# EAGLE design Mergen Telemetri + Ateşleme (EAGLE 9.6.2)

## Sheet 1 of 7
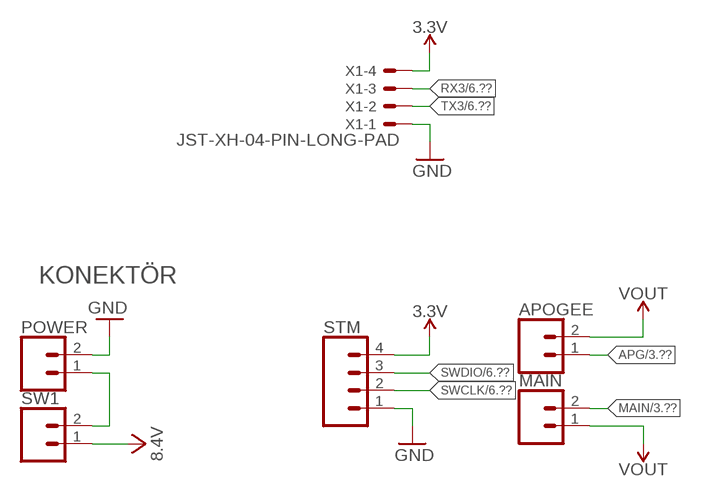
[diagram p0: schematic, sheet 1]

### Parts
APOGEE  CONN_023.5MM-NO_SILK  [SCREWTERMINAL-3.5MM-2-NS]
MAIN  CONN_023.5MM-NO_SILK  [SCREWTERMINAL-3.5MM-2-NS]
POWER  CONN_023.5MM-NO_SILK  [SCREWTERMINAL-3.5MM-2-NS]
STM  CONN_04  [1X04]
SW1  CONN_023.5MM-NO_SILK  [SCREWTERMINAL-3.5MM-2-NS]
X1  JST-XH-04-PIN-LONG-PAD  [JST-XH-04-PACKAGE-LONG-PAD]

### Nets
3.3V: STM.4 X1.4 ; also sheet 2,4,6,7
APG: APOGEE.1 ; also sheet 3
GND: POWER.2 STM.1 X1.1 ; also sheet 2,3,4,5,6,7
MAIN: MAIN.2 ; also sheet 3
N$9: POWER.1 SW1.2
RX3: X1.3 ; also sheet 6
SWCLK: STM.2 ; also sheet 6
SWDIO: STM.3 ; also sheet 6
TX3: X1.2 ; also sheet 6
VCC: SW1.1 ; supply symbol labelled 8.4V ; also sheet 7
VOUT: APOGEE.2 MAIN.1 ; also sheet 7

### Notes on the sheet
- KONEKTÖR

## Sheet 2 of 7
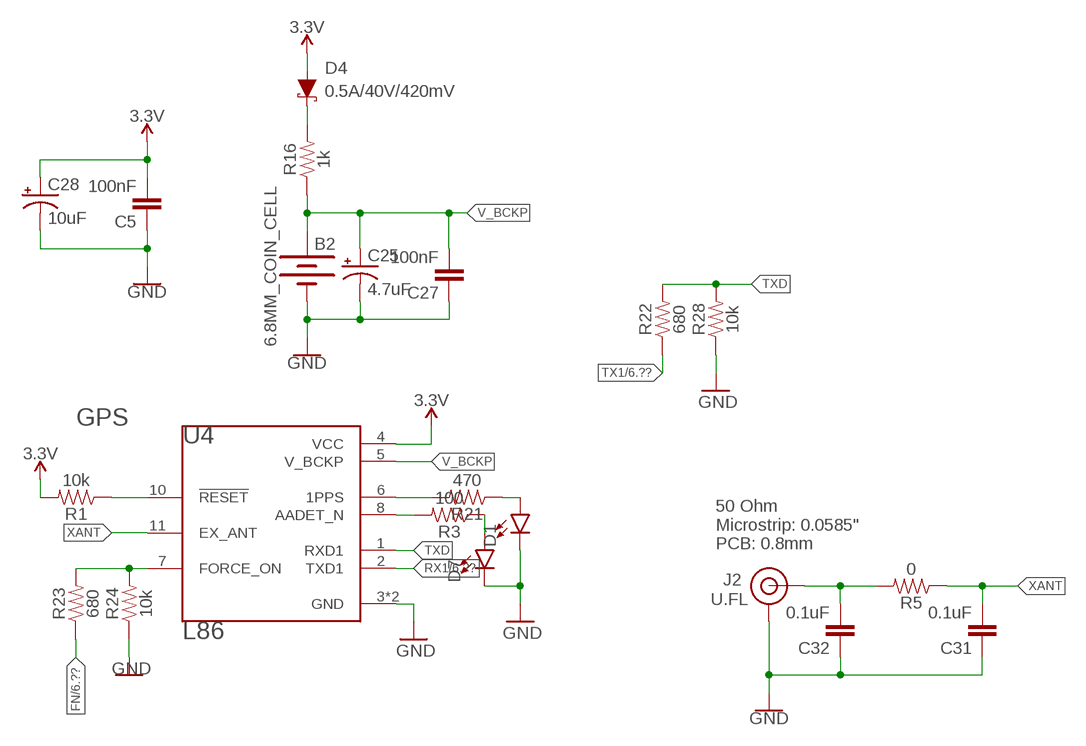
[diagram p1: schematic, sheet 2]

### Parts
B2  6.8MM_COIN_CELL  BATTERY-6.8MM_SMD  [BATTCON-6.8MM]
C5  100nF  1.0UF-0603-16V-10%  [0603]
C25  4.7uF  10UF-POLAR-EIA3216-16V-10%(TANT)  [EIA3216]
C27  100nF  1.0UF-0603-16V-10%  [0603]
C28  10uF  10UF-POLAR-EIA3216-16V-10%(TANT)  [EIA3216]
C31  0.1uF  1.0UF-0603-16V-10%  [0603]
C32  0.1uF  1.0UF-0603-16V-10%  [0603]
D1  LED0603  [LED-0603]
D4  0.5A/40V/420mV  DIODE-SCHOTTKY-PMEG4005EJ  [SOD-323]
D7  LED0603  [LED-0603]
J2  U.FL  U.FL2PIN  [U.FL]
R1  10k  1KOHM-0603-1/10W-1%  [0603]
R3  100  1KOHM-0603-1/10W-1%  [0603]
R5  0  1KOHM-0603-1/10W-1%  [0603]
R16  1k  1KOHM-0603-1/10W-1%  [0603]
R21  470  1KOHM-0603-1/10W-1%  [0603]
R22  680  1KOHM-0603-1/10W-1%  [0603]
R23  680  1KOHM-0603-1/10W-1%  [0603]
R24  10k  1KOHM-0603-1/10W-1%  [0603]
R28  10k  1KOHM-0603-1/10W-1%  [0603]
U4  L86  [XCVR_L86]

### Nets
3.3V: C5.2 C28.+ D4.A R1.2 U4.4(VCC) ; also sheet 1,4,6,7
FN: R23.1 ; also sheet 6
GND: B2.- C5.1 C25.- C27.1 C28.- C31.1 C32.1 D1.C D7.C J2.1(GND) J2.2(GND) R24.1 R28.1 U4.3(GND) U4.12(GND) ; also sheet 1,3,4,5,6,7
N$3: R1.1 U4.10(!RESET)
N$10: R21.2 U4.6(1PPS)
N$11: D1.A R21.1
N$12: D4.C R16.2
N$16: R3.2 U4.8(AADET_N)
N$17: D7.A R3.1
N$19: C32.2 J2.FEED(SIGNAL) R5.2
N$20: R23.2 R24.2 U4.7(FORCE_ON)
RX1: U4.2(TXD1) ; also sheet 6
TX1: R22.1 ; also sheet 6
TXD: R22.2 R28.2 U4.1(RXD1)
V_BCKP: B2.+ C25.+ C27.2 R16.1 U4.5(V_BCKP)
XANT: C31.2 R5.1 U4.11(EX_ANT)

### Notes on the sheet
- GPS
- 50 Ohm 
  Microstrip: 0.0585"
  PCB: 0.8mm

## Sheet 3 of 7
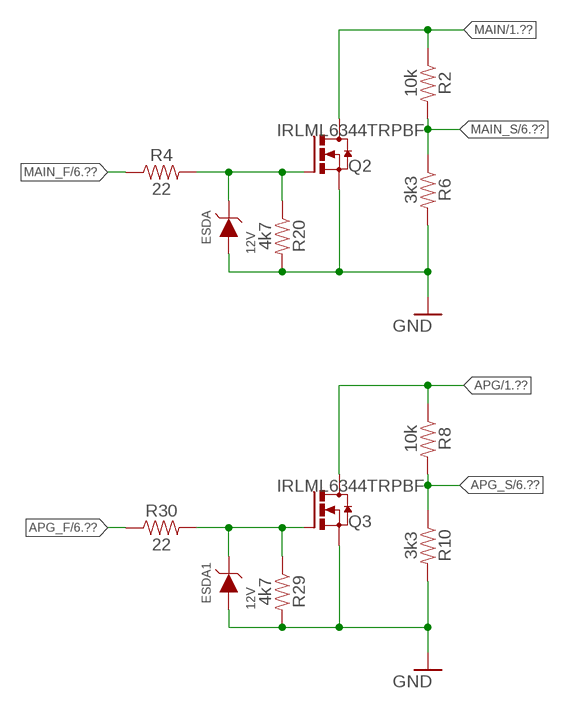
[diagram p2: schematic, sheet 3]

### Parts
ESDA  12V  WE-TVSP_DO-214AC_400W_UNI_824500102  [WE-TVSP_DO-214AC_UNIDIRECTIONAL]
ESDA1  12V  WE-TVSP_DO-214AC_400W_UNI_824500102  [WE-TVSP_DO-214AC_UNIDIRECTIONAL]
Q2  IRLML6344TRPBF  [SOT23]
Q3  IRLML6344TRPBF  [SOT23]
R2  10k  1KOHM-0603-1/10W-1%  [0603]
R4  22  1KOHM-0603-1/10W-1%  [0603]
R6  3k3  1KOHM-0603-1/10W-1%  [0603]
R8  10k  1KOHM-0603-1/10W-1%  [0603]
R10  3k3  1KOHM-0603-1/10W-1%  [0603]
R20  4k7  1KOHM-0603-1/10W-1%  [0603]
R29  4k7  1KOHM-0603-1/10W-1%  [0603]
R30  22  1KOHM-0603-1/10W-1%  [0603]

### Nets
APG: Q3.3(D) R8.1 ; also sheet 1
APG_F: R30.1 ; also sheet 6
APG_S: R8.2 R10.1 ; also sheet 6
GND: ESDA1.2(A) ESDA.2(A) Q2.2(S) Q3.2(S) R6.2 R10.2 R20.2 R29.2 ; also sheet 1,2,4,5,6,7
MAIN: Q2.3(D) R2.1 ; also sheet 1
MAIN_F: R4.1 ; also sheet 6
MAIN_S: R2.2 R6.1 ; also sheet 6
N$6: ESDA1.1(C) Q3.1(G) R29.1 R30.2
N$13: ESDA.1(C) Q2.1(G) R4.2 R20.1

## Sheet 4 of 7
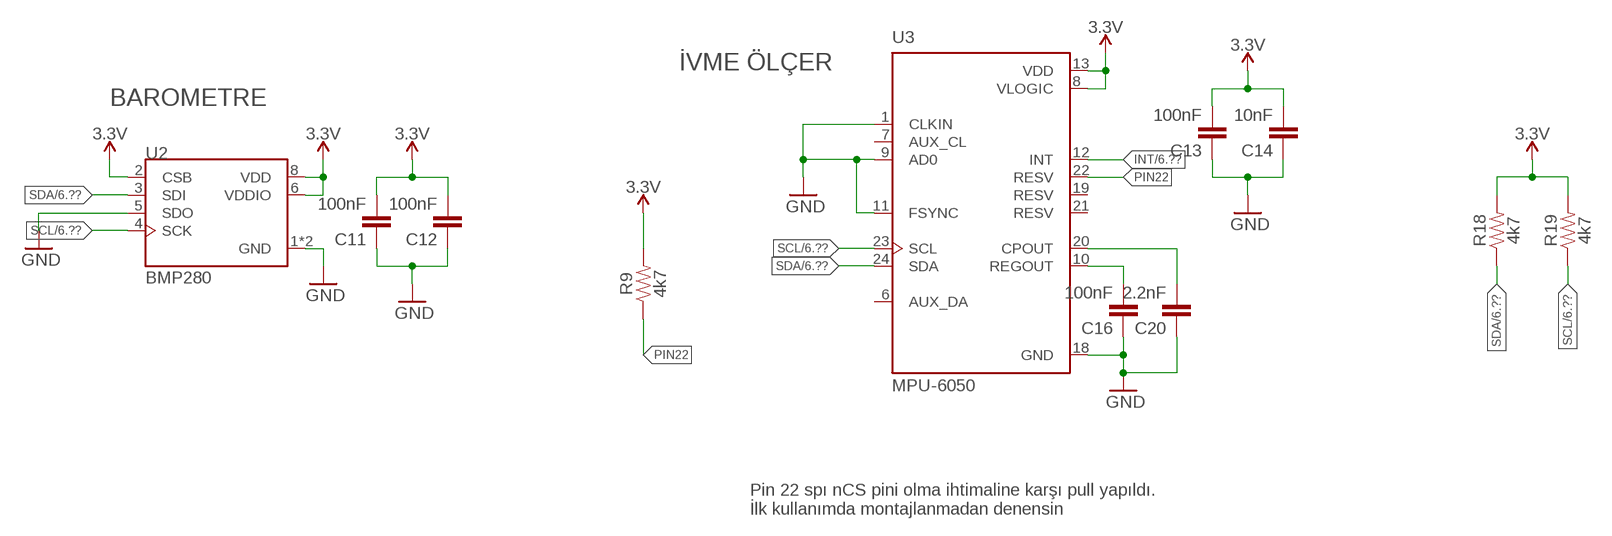
[diagram p3: schematic, sheet 4]

### Parts
C11  100nF  1.0UF-0603-16V-10%  [0603]
C12  100nF  1.0UF-0603-16V-10%  [0603]
C13  100nF  1.0UF-0603-16V-10%  [0603]
C14  10nF  1.0UF-0603-16V-10%  [0603]
C16  100nF  1.0UF-0603-16V-10%  [0603]
C20  2.2nF  1.0UF-0603-16V-10%  [0603]
R9  4k7  1KOHM-0603-1/10W-1%  [0603]
R18  4k7  1KOHM-0603-1/10W-1%  [0603]
R19  4k7  1KOHM-0603-1/10W-1%  [0603]
U2  BMP280  [XDCR_BMP280]
U3  MPU-6050  [QFN50P400X400X95-24N]

### Nets
3.3V: C11.2 C12.2 C13.2 C14.2 R9.2 R18.2 R19.2 U2.2(CSB) U2.6(VDDIO) U2.8(VDD) U3.8(VLOGIC) U3.13(VDD) ; also sheet 1,2,6,7
GND: C11.1 C12.1 C13.1 C14.1 C16.1 C20.1 U2.1(GND) U2.5(SDO) U2.7(GND) U3.1(CLKIN) U3.9(AD0) U3.11(FSYNC) U3.18(GND) ; also sheet 1,2,3,5,6,7
INT: U3.12(INT) ; also sheet 6
N$18: C16.2 U3.10(REGOUT)
N$22: C20.2 U3.20(CPOUT)
PIN22: R9.1 U3.22(RESV)
SCL: R19.1 U2.4(SCK) U3.23(SCL) ; also sheet 6
SDA: R18.1 U2.3(SDI) U3.24(SDA) ; also sheet 6
Unconnected: U3.6(AUX_DA) U3.7(AUX_CL) U3.19(RESV) U3.21(RESV)

### Notes on the sheet
- İVME ÖLÇER
- BAROMETRE
- Pin 22 spı nCS pini olma ihtimaline karşı pull yapıldı. 
  İlk kullanımda montajlanmadan denensin

## Sheet 5 of 7
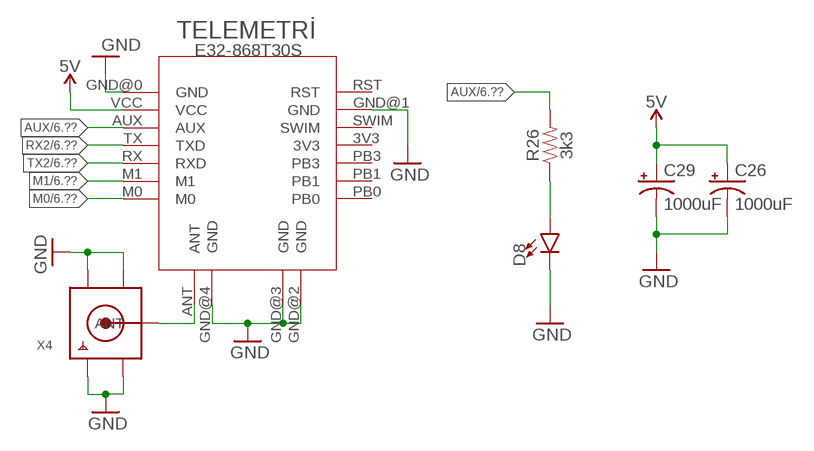
[diagram p4: schematic, sheet 5]

### Parts
C26  1000uF  CPOL-US150CLZ-1010  [150CLZ-1010]
C29  1000uF  CPOL-US150CLZ-1010  [150CLZ-1010]
D8  LED0603  [LED-0603]
R26  3k3  1KOHM-0603-1/10W-1%  [0603]
U5  E32-868T30S  [E32-868T30S]
X4  SMACONNECTOR  [SMA90_DIP]

### Nets
5V: C26.+ C29.+ U5.VCC ; also sheet 7
AUX: R26.2 U5.AUX ; also sheet 6
GND: C26.- C29.- D8.C U5.GND@0(GND) U5.GND@1(GND) U5.GND@2(GND) U5.GND@3(GND) U5.GND@4(GND) X4.GND1 X4.GND2 X4.GND3 X4.GND4 ; also sheet 1,2,3,4,6,7
M0: U5.M0 ; also sheet 6
M1: U5.M1 ; also sheet 6
N$7: U5.ANT X4.ANTENNA(ANT)
N$21: D8.A R26.1
RX2: U5.TX(TXD) ; also sheet 6
TX2: U5.RX(RXD) ; also sheet 6
Unconnected: U5.3V3 U5.PB0 U5.PB1 U5.PB3 U5.RST U5.SWIM

### Notes on the sheet
- TELEMETRİ

## Sheet 6 of 7
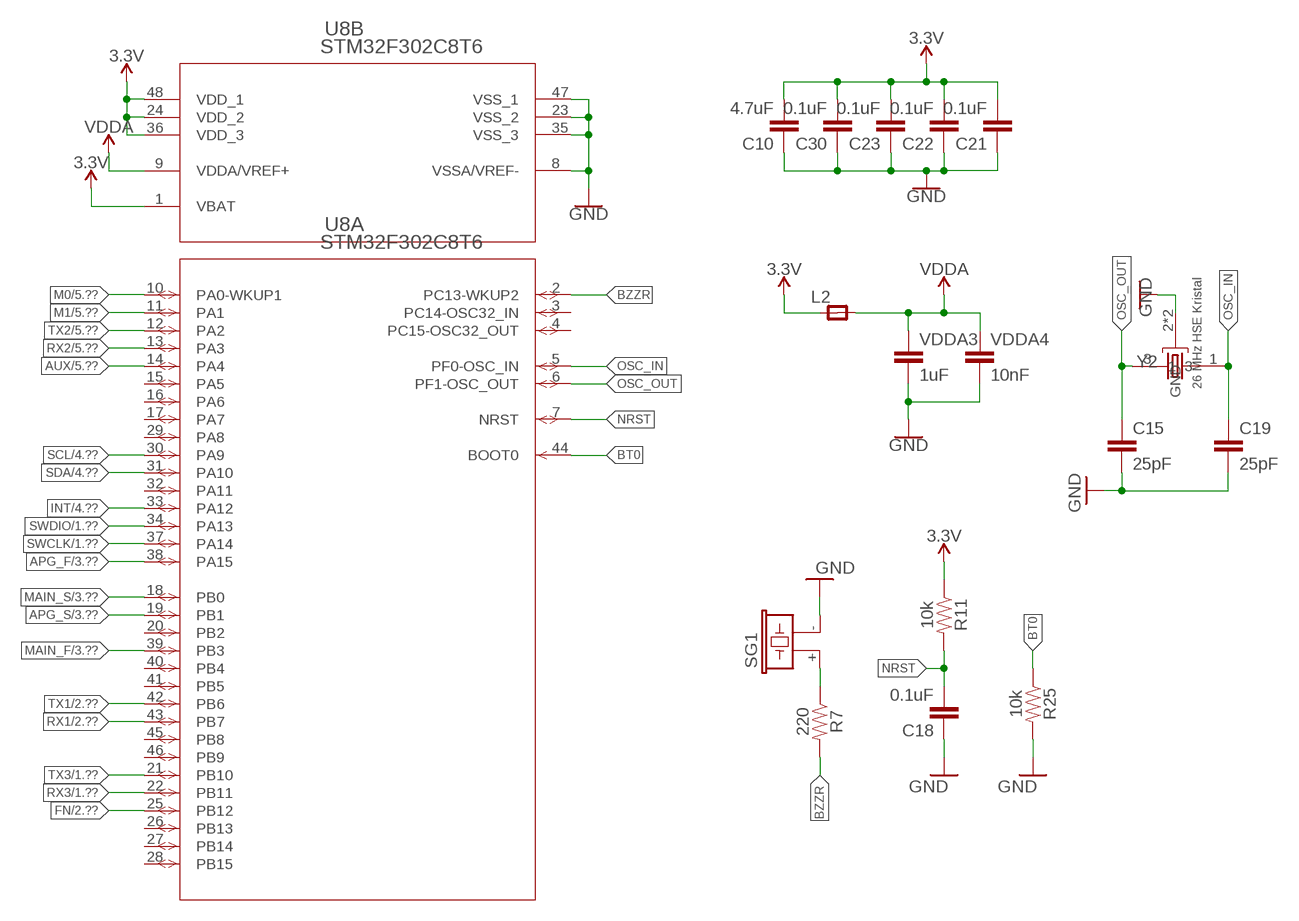
[diagram p5: schematic, sheet 6]

### Parts
C10  4.7uF  1.0UF-0603-16V-10%  [0603]
C15  25pF  1.0UF-0603-16V-10%  [0603]
C18  0.1uF  1.0UF-0603-16V-10%  [0603]
C19  25pF  1.0UF-0603-16V-10%  [0603]
C21  0.1uF  1.0UF-0603-16V-10%  [0603]
C22  0.1uF  1.0UF-0603-16V-10%  [0603]
C23  0.1uF  1.0UF-0603-16V-10%  [0603]
C30  0.1uF  1.0UF-0603-16V-10%  [0603]
L2  RC-MASTER-SMD_FB_0805MP  [RC-MASTER-SMD_L0805MP]
R7  220  1KOHM-0603-1/10W-1%  [0603]
R11  10k  1KOHM-0603-1/10W-1%  [0603]
R25  10k  1KOHM-0603-1/10W-1%  [0603]
SG1  F/CM12P  [F/CM12P]
U8  STM32F302C8T6  [LQFP48-7X7MM]
VDDA3  1uF  0.1UF-0603-25V-(+80/-20%)  [0603]
VDDA4  10nF  0.1UF-0603-25V-(+80/-20%)  [0603]
Y2  ABM3B-26.000MHZ-10-1-U-T  [OSCCC500X320X110-4N]

### Nets
3.3V: C10.2 C21.2 C22.2 C23.2 C30.2 L2.1 R11.1 U8.1(B:VBAT) U8.24(B:VDD_2) U8.36(B:VDD_3) U8.48(B:VDD_1) ; also sheet 1,2,4,7
APG_F: U8.38(A:PA15) ; also sheet 3
APG_S: U8.19(A:PB1) ; also sheet 3
AUX: U8.14(A:PA4) ; also sheet 5
BT0: R25.1 U8.44(A:BOOT0)
BZZR: R7.2 U8.2(A:PC13-WKUP2)
FN: U8.25(A:PB12) ; also sheet 2
GND: C10.1 C15.2 C18.1 C19.2 C21.1 C22.1 C23.1 C30.1 R25.2 SG1.- U8.8(B:VSSA/VREF-) U8.23(B:VSS_2) U8.35(B:VSS_3) U8.47(B:VSS_1) VDDA3.2 VDDA4.2 Y2.2(GND) Y2.4(GND) ; also sheet 1,2,3,4,5,7
INT: U8.33(A:PA12) ; also sheet 4
M0: U8.10(A:PA0-WKUP1) ; also sheet 5
M1: U8.11(A:PA1) ; also sheet 5
MAIN_F: U8.39(A:PB3) ; also sheet 3
MAIN_S: U8.18(A:PB0) ; also sheet 3
N$8: R7.1 SG1.+
NRST: C18.2 R11.2 U8.7(A:NRST)
OSC_IN: C19.1 U8.5(A:PF0-OSC_IN) Y2.1
OSC_OUT: C15.1 U8.6(A:PF1-OSC_OUT) Y2.3
RX1: U8.43(A:PB7) ; also sheet 2
RX2: U8.13(A:PA3) ; also sheet 5
RX3: U8.22(A:PB11) ; also sheet 1
SCL: U8.30(A:PA9) ; also sheet 4
SDA: U8.31(A:PA10) ; also sheet 4
SWCLK: U8.37(A:PA14) ; also sheet 1
SWDIO: U8.34(A:PA13) ; also sheet 1
TX1: U8.42(A:PB6) ; also sheet 2
TX2: U8.12(A:PA2) ; also sheet 5
TX3: U8.21(A:PB10) ; also sheet 1
VDDA: L2.2 U8.9(B:VDDA/VREF+) VDDA3.1 VDDA4.1
Unconnected: U8.3(A:PC14-OSC32_IN) U8.4(A:PC15-OSC32_OUT) U8.15(A:PA5) U8.16(A:PA6) U8.17(A:PA7) U8.20(A:PB2) U8.26(A:PB13) U8.27(A:PB14) U8.28(A:PB15) U8.29(A:PA8) U8.32(A:PA11) U8.40(A:PB4) U8.41(A:PB5) U8.45(A:PB8) U8.46(A:PB9)

### Notes on the sheet
- 26 MHz HSE Kristal

## Sheet 7 of 7
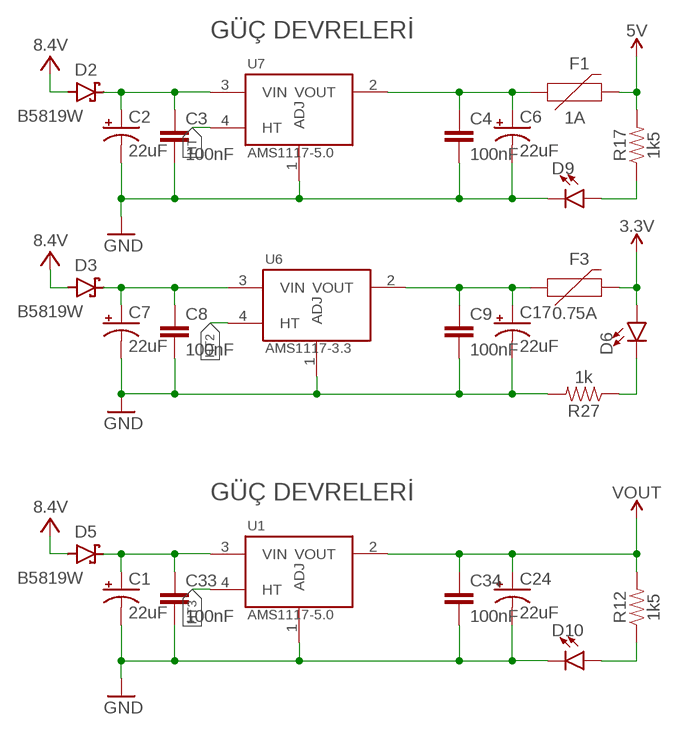
[diagram p6: schematic, sheet 7]

### Parts
C1  22uF  47UF-POLAR-EIA3528-10V-10%  [EIA3528]
C2  22uF  47UF-POLAR-EIA3528-10V-10%  [EIA3528]
C3  100nF  1.0UF-0603-16V-10%  [0603]
C4  100nF  1.0UF-0603-16V-10%  [0603]
C6  22uF  47UF-POLAR-EIA3528-10V-10%  [EIA3528]
C7  22uF  47UF-POLAR-EIA3528-10V-10%  [EIA3528]
C8  100nF  1.0UF-0603-16V-10%  [0603]
C9  100nF  1.0UF-0603-16V-10%  [0603]
C17  22uF  47UF-POLAR-EIA3528-10V-10%  [EIA3528]
C24  22uF  47UF-POLAR-EIA3528-10V-10%  [EIA3528]
C33  100nF  1.0UF-0603-16V-10%  [0603]
C34  100nF  1.0UF-0603-16V-10%  [0603]
D2  B5819W  SCHOTTKY_MBR0520LT1GDO-219  [SODFL3718X115]
D3  B5819W  SCHOTTKY_MBR0520LT1GDO-219  [SODFL3718X115]
D5  B5819W  SCHOTTKY_MBR0520LT1GDO-219  [SODFL3718X115]
D6  LED0603  [LED-0603]
D9  LED0603  [LED-0603]
D10  LED0603  [LED-0603]
F1  1A  PPTC_HALF-AMP  [1206]
F3  0.75A  PPTC_HALF-AMP  [1206]
R12  1k5  1KOHM-0603-1/10W-1%  [0603]
R17  1k5  1KOHM-0603-1/10W-1%  [0603]
R27  1k  1KOHM-0603-1/10W-1%  [0603]
U1  AMS1117-5.0  AMS1117-3.3  [SOT229P700X180-4N]
U6  AMS1117-3.3  [SOT229P700X180-4N]
U7  AMS1117-5.0  AMS1117-3.3  [SOT229P700X180-4N]

### Nets
3.3V: D6.A F3.2 ; also sheet 1,2,4,6
5V: F1.2 R17.2 ; also sheet 5
GND: C1.C(-) C2.C(-) C3.2 C4.2 C6.C(-) C7.C(-) C8.2 C9.2 C17.C(-) C24.C(-) C33.2 C34.2 D9.C D10.C R27.2 U1.1(ADJ) U6.1(ADJ) U7.1(ADJ) ; also sheet 1,2,3,4,5,6
HT: U7.4(HT)
HT2: U6.4(HT)
HT3: U1.4(HT)
N$1: C2.A(+) C3.1 D2.1(C) U7.3(VIN)
N$2: C7.A(+) C8.1 D3.1(C) U6.3(VIN)
N$4: C4.1 C6.A(+) F1.1 U7.2(VOUT)
N$5: C9.1 C17.A(+) F3.1 U6.2(VOUT)
N$14: D9.A R17.1
N$15: D6.C R27.1
N$23: C1.A(+) C33.1 D5.1(C) U1.3(VIN)
N$25: D10.A R12.1
VCC: D2.2(A) D3.2(A) D5.2(A) ; supply symbol labelled 8.4V ; also sheet 1
VOUT: C24.A(+) C34.1 R12.2 U1.2(VOUT) ; also sheet 1

### Notes on the sheet
- GÜÇ DEVRELERİ
- GÜÇ DEVRELERİ

## Library data of the parts
APOGEE MAIN POWER SW1 = SparkFun-Connectors:CONN_02: Multi connection point. Often used as Generic Header-pin footprint for 0.1 inch spaced/style header connections On any of the 0.1 inch spaced packages, you can populate with these: Break Away Headers - Straight <https://www.sparkfun.com/products/116> (PRT-00116) Break Away Male Headers - Right Angle <https://www.sparkfun.com/products/553> (PRT-00553) Female Headers <https://www.sparkfun.com/products/115> (PRT-00115) Break Away Headers - Machine Pin <https://www.sparkfun.com/products/117> (PRT-00117) Break Away Female Headers - Swiss Machine Pin <https://www.sparkfun.com/products/743> (PRT-00743) For SCREWTERMINALS and SPRING TERMINALS visit here: Screw Terimnals on SparkFun.com <https://www.sparkfun.com/search/results?term=Screw+Terminals> (5mm/3.5mm/2.54mm spacing) This device is also useful as a general connection point to wire up your design to another part of your project. Our various solder wires solder well into these plated through hole pads. Hook-Up Wire - Assortment (Stranded, 22 AWG) <https://www.sparkfun.com/products/11375> (PRT-11375) Hook-Up Wire - Assortment (Solid Core, 22 AWG) <https://www.sparkfun.com/products/11367> (PRT-11367) View the entire wire category on our website here <https://www.sparkfun.com/categories/141> Special notes: Molex polarized connector foot print use with: PRT-08233 with associated crimp pins and housings. 2.54_SCREWTERM for use with PRT-10571. 3.5mm Screw Terminal footprints for PRT-08084 5mm Screw Terminal footprints for use with PRT-08432; PROD_ID: CONN-08399
B2 = SparkFun-Batteries:BATTERY: Battery - Single Cell A variety of battery chemistries, sizes, and footprints. Device List: 20MM_PTH - Coin Cell Battery Holder - 20mm (PTH) <https://www.sparkfun.com/products/783> 6.8MM_PTH - Coin Cell Battery Holder - 6.8MM(SMD) <https://www.digikey.com/product-detail/en/seiko-instruments/MS621FE-FL11E/728-1057-ND/1889208?WT.srch=1&gclid=CNOQ5a6LzdQCFZS2wAodXCkE0g> 12MM_SMD - Coin Cell Battery Holder - 12mm (SMD) <https://www.sparkfun.com/products/10592> 12MM_PTH - Coin Cell Battery Holder - 12mm (PTH) <https://www.sparkfun.com/products/7948> 20MM_SMD - 20mm Coin Cell Battery Holder (SMD) (2 legs) Used on the Big Time Watch Kit <https://www.sparkfun.com/products/11734> 20MM_SMD_4LEGS - Coin Cell Battery Holder - 20mm (SMD) <https://www.sparkfun.com/products/11892> 20MM_SMD_4LEGS_OVERPASTE - Coin Cell Battery Holder - 20mm (SMD) <https://www.sparkfun.com/products/11892> (Over-paste on the legs) 24.5MM_PTH - Coin Cell Battery Holder - 24.5mm (PTH) <https://www.sparkfun.com/products/8863> 9V - 9V Battery Holder - PC Mount Used on the SparkFun SparkPunk Sound Kit <https://www.sparkfun.com/products/11177> and SparkFun SparkPunk Sequencer Kit <https://www.sparkfun.com/products/12707> 18650 - Battery Holder - 18650 (PTH) <https://www.sparkfun.com/products/13113> AA - Battery Holder - 1xAA (PTH) <https://www.sparkfun.com/products/7949> AAA - Battery Holder - 1xAAA (PTH) <https://www.sparkfun.com/products/12718> AA_KIT - Battery Holder - 1xAA (PTH) <https://www.sparkfun.com/products/7949> Special kit package - pads only have exposed copper on one side of the board. AAA_KIT - Battery Holder - 1xAAA (PTH) <https://www.sparkfun.com/products/12718> Special kit package - pads only have exposed copper on one side of the board.; PROD_ID: BATT-13734
C1 C2 C6 C7 C17 C24 = SparkFun-Capacitors:47UF-POLAR: 47µF polarized capacitors A capacitor is a passive two-terminal electrical component used to store electrical energy temporarily in an electric field.; PROD_ID: CAP-08310; VALUE: 47uF
C3-C5 C8-C16 C18-C23 C27 C30-C34 = SparkFun-Capacitors:1.0UF: 1µF ceramic capacitors A capacitor is a passive two-terminal electrical component used to store electrical energy temporarily in an electric field.; PROD_ID: CAP-00868; VALUE: 1.0uF
C25 = SparkFun-Capacitors:10UF-POLAR: 10.0µF polarized capacitors A capacitor is a passive two-terminal electrical component used to store electrical energy temporarily in an electric field.; PROD_ID: CAP-00811; VALUE: 10uF
C26 C29 = adafruit:CPOL-US: POLARIZED CAPACITOR, American symbol
C28 = SparkFun-Capacitors:10UF-POLAR: 10.0µF polarized capacitors A capacitor is a passive two-terminal electrical component used to store electrical energy temporarily in an electric field.; PROD_ID: CAP-00811
D1 D6-D10 = SparkFun-LED:LED: LED (Generic) Standard schematic elements and footprints for 5mm, 3mm, 1206, and 0603 sized LEDs. Generic LEDs with no color specified.
D2 D3 D5 = Diode:SCHOTTKY_: Schottky Diode - Popular parts; CATEGORY: Diode; DESCRIPTION: DIODE SCHOTTKY 20V 500MA SOD123; MANUFACTURER: ON Semiconductor; MPN: MBR0520LT1G; SUB-CATEGORY: Schottky; VALUE: MBR0520LT1G
D4 = SparkFun-DiscreteSemi:DIODE-SCHOTTKY: Schottky diode A Schottky diode is a semiconductor diode which has a low forward voltage drop and a very fast switching action.; PROD_ID: DIO-10955
ESDA ESDA1 = Wurth_EMC Components_WE-TVSP:WE-TVSP_DO-214AC_400W_UNI: WE-TVSP Power TVS Diode Characteristics Low Profile Package Glass passivated Juction Excellent clamping capability Fast response time MSL Level 1, per J-STD-020 Classification of the plastic case: UL 94 V-0 Safety certification UL 497B, E478010 Identical design: - DO-214AC = SMAJ - DO-214AA = SMBJ - DO-214AB = SMCJ/SMDJ Applications Ideal to protect the I/O Interfaces, Bus Voltage and other circuits of sensetive electronic equipment against voltage transiensts <https://www.we-online.com/catalog/media/o55793v209%20WE-TVSP_600W-3000W_D0214AA_4C.jpg> Details see: https://www.we-online.com/catalog/en/WE-TVSP/ Updated by Ella Wu 2020-07-20 2020 (C) Würth Elektronik; DATASHEET-URL: https://www.we-online.com/catalog/datasheet/824500102.pdf; IPEAK: 2.5A; MOUNT: SMT; PART-NUMBER: 824500102; PDISS: 400W; VALUE: 100V; VBR: 117V; VCLAMP: 162V
F1 F3 = SparkFun-Fuses:PPTC: Resettable Fuse PPTC Resettable Fuse. Really a sort of resistor with a polymeric positive temperature coefficient whose resistance increases dramatically with an increase in temperature. When heated by the power passing through the resistance rises causing the current to be limited, protecting the circuit. This is achieved by the transition of the polymer from a crystalline to an amorphous state where the conductive carbon separates breaking the conductive pathways found in the cool crystalline structure. When a PPTC cools back down it resumes conducting letting the circuit turn back on. SparkFun Products: SparkFun RedBoard - Programmed with Arduino <https://www.sparkfun.com/products/12757> Pro Micro - 5V/16MHz <https://www.sparkfun.com/products/12640> Arduino Pro 328 - 5V/16MHz <https://www.sparkfun.com/products/10915> MP3 Trigger <https://www.sparkfun.com/products/13720>; PROD_ID: RES-08585; VALUE: 6V/0.5A
J2 = SparkFun-Connectors:U.FL2PIN: SMD Antenna Connector - U.FL 2mm height, 3.0mm x 3.0mm receptacle size. SparkFun Products: SparkFun WiFi Shield - ESP8266 <https://www.sparkfun.com/products/13287> SparkFun ESP8266 Thing <https://www.sparkfun.com/products/13231> SparkFun MiniGen - Pro Mini Signal Generator Shield <https://www.sparkfun.com/products/11420>; PROD_ID: CONN-09193; SF_ID: WRL-09144
L2 = 52101-101-REV-A_v16:RC-MASTER-SMD_FB_: FERRITE BEAD
Q2 Q3 = IRLML6344TRPBF (1):IRLML6344TRPBF: Transistor NMOS 30V 6.3A, 29mOhm@4.5V; AVAILABILITY: Unavailable; DESCRIPTION: RoHS Compliant | Low RDS(on) | Industry-Standard Pinout | Compatible with Existing Surface Mount Techniques | Qualified MSL1 | SOT-23 Footprint; MF: Infineon; MP: IRLML6344TRPBF; PACKAGE: SOT-23-3 International Rectifier; PRICE: None
R1-R12 R17-R26 R28-R30 = SparkFun-Resistors:1KOHM: 1kΩ resistor A resistor is a passive two-terminal electrical component that implements electrical resistance as a circuit element. Resistors act to reduce current flow, and, at the same time, act to lower voltage levels within circuits. - Wikipedia; PROD_ID: RES-07856; VALUE: 1k
R16 R27 = SparkFun-Resistors:1KOHM: 1kΩ resistor A resistor is a passive two-terminal electrical component that implements electrical resistance as a circuit element. Resistors act to reduce current flow, and, at the same time, act to lower voltage levels within circuits. - Wikipedia; PROD_ID: RES-07856
SG1 = buzzer:F/CM12P: BUZZER Source: Buerklin; OC_FARNELL: unknown; OC_NEWARK: unknown
STM = SparkFun-Connectors:CONN_04: Multi connection point. Often used as Generic Header-pin footprint for 0.1 inch spaced/style header connections On any of the 0.1 inch spaced packages, you can populate with these: Break Away Headers - Straight <https://www.sparkfun.com/products/116> (PRT-00116) Break Away Male Headers - Right Angle <https://www.sparkfun.com/products/553> (PRT-00553) Female Headers <https://www.sparkfun.com/products/115> (PRT-00115) Break Away Headers - Machine Pin <https://www.sparkfun.com/products/117> (PRT-00117) Break Away Female Headers - Swiss Machine Pin <https://www.sparkfun.com/products/743> (PRT-00743) For SCREWTERMINALS and SPRING TERMINALS visit here: Screw Terimnals on SparkFun.com <https://www.sparkfun.com/search/results?term=Screw+Terminals> (5mm/3.5mm/2.54mm spacing) This device is also useful as a general connection point to wire up your design to another part of your project. Our various solder wires solder well into these plated through hole pads. Hook-Up Wire - Assortment (Stranded, 22 AWG) <https://www.sparkfun.com/products/11375> (PRT-11375) Hook-Up Wire - Assortment (Solid Core, 22 AWG) <https://www.sparkfun.com/products/11367> (PRT-11367) View the entire wire category on our website here <https://www.sparkfun.com/categories/141> Special notes: Molex polarized connector foot print use with SKU : PRT-08231 with associated crimp pins and housings. 1MM SMD Version SKU: PRT-10208; PROD_ID: CONN-09696
U1 U6 U7 = AMS1117-3.3:AMS1117-3.3: Sot223/Pkg 1-Amp 3.3-Volt Low Drop Out Voltage Regulatator; AVAILABILITY: Unavailable; DESCRIPTION: Sot223/Pkg 1-Amp 3.3-Volt Low Drop Out Voltage Regulatator; MF: Advanced Monolithic Systems; MP: AMS1117-3.3; PACKAGE: SOT-89 ams; PRICE: None
U2 = BMP280:BMP280: BMP280 Absolute Barometric Pressure Sensor for Battery Powered Devices 2 x 2.5mm Check prices <https://pricing.snapeda.com/parts/BMP280/Bosch/view-part?ref=eda>; AVAILABILITY: Warning; DESCRIPTION: Pressure Sensor 4.35PSI ~ 15.95PSI (30kPa ~ 110kPa) Absolute 16b 8-SMD; MF: Bosch; MP: BMP280; PACKAGE: SMD-8 Bosch Sensortec; PRICE: None; PURCHASE-URL: https://pricing.snapeda.com/search/part/BMP280/?ref=eda
U3 = MPU-6050:MPU-6050: MPU-6050 Six-Axis (Gyro + Accelerometer) MEMS MotionTracking™ Devices Check prices <https://pricing.snapeda.com/parts/MPU-6050/TDK%20InvenSense/view-part?ref=eda>; AVAILABILITY: Warning; DESCRIPTION: Accelerometer, Gyroscope, 6 Axis Sensor I²C Output; MF: TDK InvenSense; MP: MPU-6050; PACKAGE: QFN-24 InvenSense; PRICE: None; PURCHASE-URL: https://pricing.snapeda.com/search/part/MPU-6050/?ref=eda
U4 = L86:L86: L86 is an ultra-compact GNSS POT (Patch on Top) module with an embedded 18.4mm × 18.4mm × 4.0mm patch antenna and utilizes the MediaTek new generation GNSS chipset MT3333 that achieves the perfect performance; AVAILABILITY: Unavailable; DESCRIPTION: L86 is an ultra-compact GNSS POT (Patch on Top) module with an embedded 18.4mm × 18.4mm × 4.0mm patch antenna and utilizes the MediaTek new generation GNSS chipset MT3333 that achieves the perfect performance; MF: Quectel; MP: L86; PACKAGE: PowerSFN-8 Quectel; PRICE: None
U5 = E32-868T30S:E32-868T30S: E BYTE E32-868T30S
U8 = STM32F302C8T6:STM32F302C8T6; BUILT_BY: EMA_UL_Team; COPYRIGHT: Copyright (C) 2018 Accelerated Designs. All rights reserved; MANUFACTURER_PART_NUMBER: STM32F302C8T6; SOURCELIBRARY: Updates_to_database_2020-10-19; VENDOR: STMicroelectronics
VDDA3 VDDA4 = SparkFun-Capacitors:0.1UF: 0.1µF ceramic capacitors A capacitor is a passive two-terminal electrical component used to store electrical energy temporarily in an electric field.; PROD_ID: CAP-00810; VALUE: 0.1uF
X1 = Rembrandt Electronics - JST XH Connectors v1-0:JST-XH-04-PIN: JST XH Connector 2 Pin Wire to board connector. Pitch: 2,54 mm, (0.100") Number of pins: 4 Created by Rembrandt Electronics www.rembrandtelectronics.com
X4 = adafruit:SMACONNECTOR: SMA Connector 90° DIP SMA Connector, 50 Ohm (4UConnector: 07259)
Y2 = ABM3B-26.000MHZ-10-1-U-T:ABM3B-26.000MHZ-10-1-U-T: Ceramic SMD Crystal Check prices <https://pricing.snapeda.com/parts/ABM3B-26.000MHZ-10-1-U-T/Abracon/view-part?ref=eda>; AVAILABILITY: Good; DESCRIPTION: 26MHz ±10ppm Crystal 10pF 50 Ohms 4-SMD, No Lead; MF: Abracon; MP: ABM3B-26.000MHZ-10-1-U-T; PACKAGE: SMD-4 Abracon LLC; PRICE: None; PURCHASE-URL: https://pricing.snapeda.com/search/part/ABM3B-26.000MHZ-10-1-U-T/?ref=eda

## Net classes
1 Power: width 0.305 mm

## Board
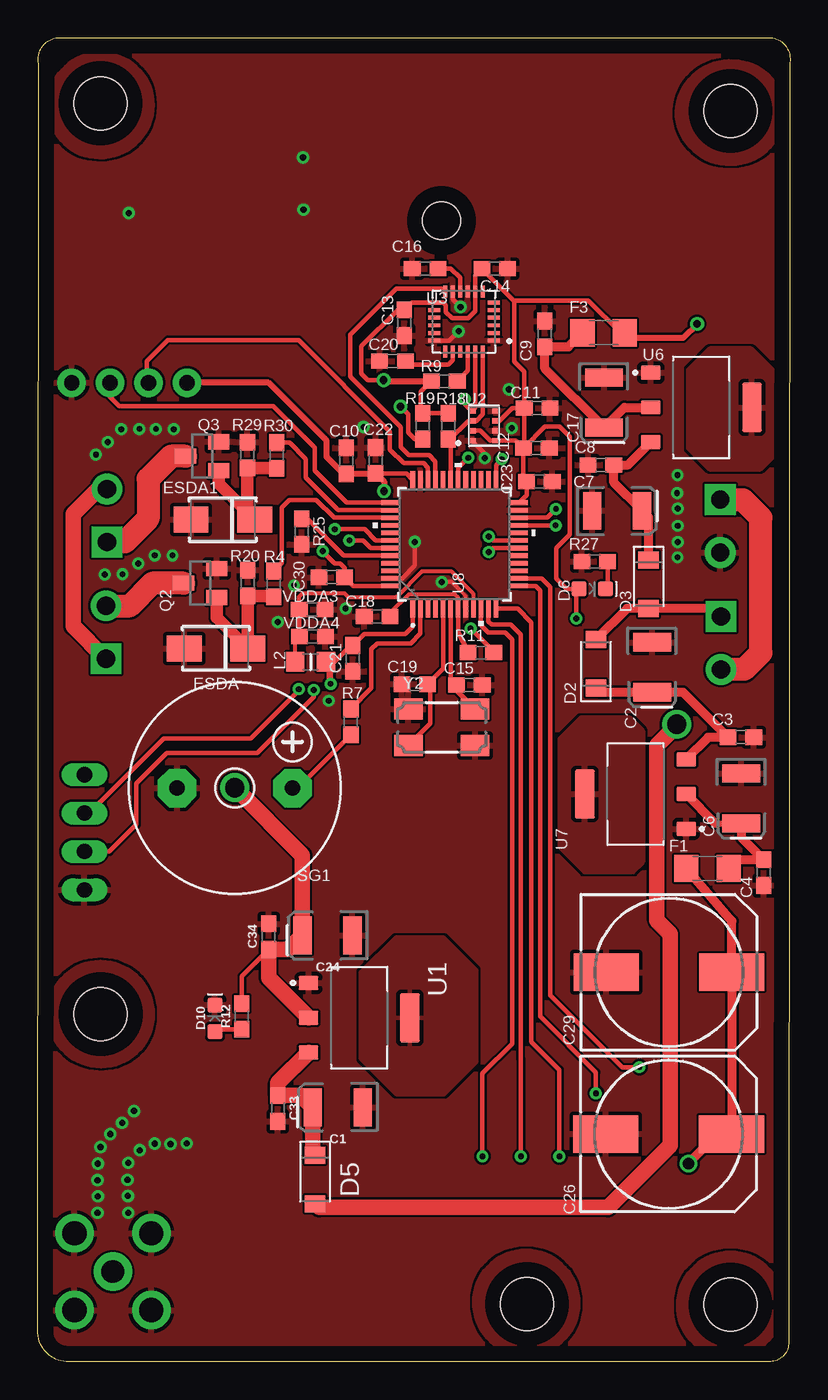
[diagram p7: board, top side]
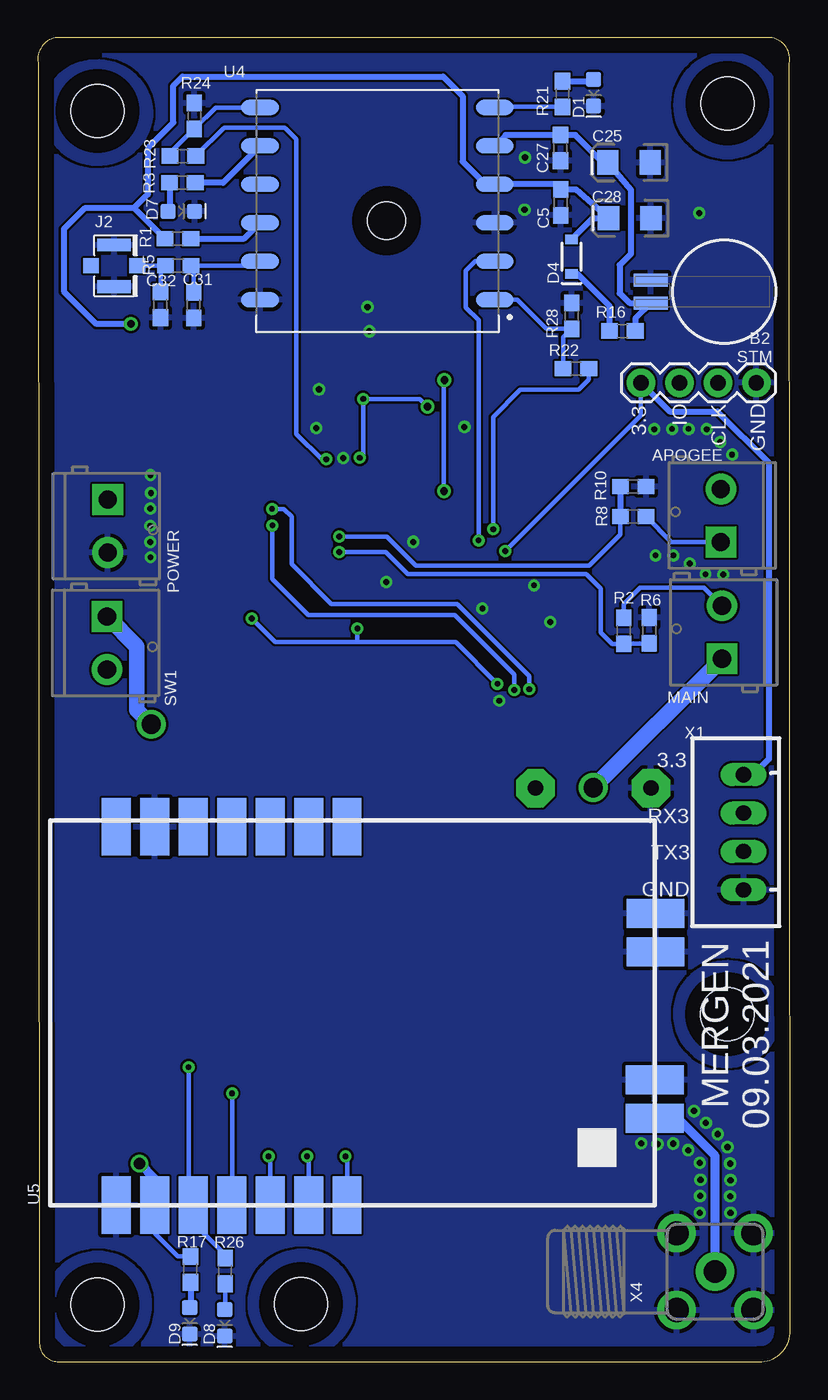
[diagram p8: board, bottom side, seen from below]

Size 49.68 x 87.45 mm. Coordinates in mm from the lower left corner, seen from the top.
Outline: 49.66,85.8 49.58,1.3 arc-90 48.38,0 2.06,0 arc-90 0,1.88 0.05,85.75 arc-90 1.19,87.45 48.52,87.45 arc-90 49.66,85.8
Copper layers (1*16): Top 0.035mm / dielectric 1.5mm / Bottom 0.035mm
Design rules "default": minimum track width 6mil, minimum drill 0.35mm, track to track 6mil, track to pad 6mil, pad to pad 6mil, via to via 6mil, smd to smd 6mil, copper to edge 40mil, drill to drill 6mil, minimum pad ring 10mil, minimum via ring 8mil, stop-mask expansion 4mil, vias tented up to drill 0mil, thermal gap 10mil
Holes 3.5 mm at 45.75,82.63 4.14,83.13 45.75,3.76 32.31,3.81 4.15,22.96
Holes 2.5 mm at 26.66,75.38

### Footprints (pad centres in the part's own frame; a part is rotated, then mirrored left to right if it is on the bottom)
SCREWTERMINAL-3.5MM-2-NS = drill 1.2 pad 2.032 square: 1 0,0 | drill 1.2 pad 2.032: 2 3.5,0
BATTCON-6.8MM = smd 2.25 x 0.85: + 4.87,0.75; - 4.87,-0.75
EIA3528 = smd 1.2 x 2.5: A 1.65,0; C -1.65,0
0603 = smd 1.1 x 1: 1 -0.85,0; 2 0.85,0
EIA3216 = smd 1.4 x 1.6: + 1.4,0; - -1.4,0
150CLZ-1010 = smd 4.3 x 2.5: + 4.15,0; - -4.15,0
LED-0603 = smd 1 x 1: A -0.877,0; C 0.877,0
SODFL3718X115 = smd 1.115 x 1.361: 1 -1.6,0; 2 1.6,0
SOD-323 = smd 0.63 x 0.83: A 1.15,0; C -1.15,0
WE-TVSP_DO-214AC_UNIDIRECTIONAL = smd 2.3 x 1.7: 1 -2.1,0; 2 2.1,0
1206 = smd 1.6 x 1.8: 1 -1.4,0; 2 1.4,0
U.FL = smd 2.2 x 0.85: 1 0,1.375; 2 0,-1.375 | smd 1.05 x 1: FEED 1.525,0; NC -1.525,0
RC-MASTER-SMD_L0805MP = smd 1.2 x 1.3: 1 -1.016,0; 2 1.016,0
SOT23 = smd 1 x 1.4: 1 -0.95,-1.1; 2 0.95,-1.1; 3 0,1.1
F/CM12P = drill 1.016 pad 2.54 octagon: + 3.81,0; - -3.81,0
1X04 = drill 1.016 pad 1.88: 1 0,0; 2 2.54,0; 3 5.08,0; 4 7.62,0
SOT229P700X180-4N = smd 0.93 x 1.31: 1 -2.29,-3.345; 2 0,-3.345; 3 2.29,-3.345 | smd 3.24 x 1.31: 4 0,3.345
XDCR_BMP280 = smd 0.5 x 0.35: 1 0.8,0.975; 2 0.8,0.325; 3 0.8,-0.325; 4 0.8,-0.975; 5 -0.8,-0.975; 6 -0.8,-0.325; 7 -0.8,0.325; 8 -0.8,0.975
QFN50P400X400X95-24N = smd 0.79 x 0.26: 1 -1.97,1.25; 2 -1.97,0.75; 3 -1.97,0.25; 4 -1.97,-0.25; 5 -1.97,-0.75; 6 -1.97,-1.25; 13 1.97,-1.25; 14 1.97,-0.75; 15 1.97,-0.25; 16 1.97,0.25; 17 1.97,0.75; 18 1.97,1.25 | smd 0.26 x 0.79: 7 -1.25,-1.97; 8 -0.75,-1.97; 9 -0.25,-1.97; 10 0.25,-1.97; 11 0.75,-1.97; 12 1.25,-1.97; 19 1.25,1.97; 20 0.75,1.97; 21 0.25,1.97; 22 -0.25,1.97; 23 -0.75,1.97; 24 -1.25,1.97
XCVR_L86 = smd 2.5 x 1: 1 -7.75,6.35; 2 -7.75,3.81; 3 -7.75,1.27; 4 -7.75,-1.27; 5 -7.75,-3.81; 6 -7.75,-6.35; 7 7.75,-6.35; 8 7.75,-3.81; 9 7.75,-1.27; 10 7.75,1.27; 11 7.75,3.81; 12 7.75,6.35
E32-868T30S = smd 3.81 x 1.905: 3V3 12.3,5.08; AUX -12.7,7.62; GND@0 -12.7,12.7; GND@1 12.3,10.16; M0 -12.7,-2.54; M1 -12.7,0; PB0 12.3,-2.54; PB1 12.3,0; PB3 12.3,2.54; RST 12.3,12.7; RX -12.7,2.54; SWIM 12.3,7.62; TX -12.7,5.08; VCC -12.7,10.16 | smd 1.905 x 3.81: ANT -6.97,-22.86; GND@2 6.57,-22.91; GND@3 4.03,-22.91; GND@4 -4.43,-22.86
LQFP48-7X7MM = smd 1.194 x 0.305: 1 -4.25,2.75; 2 -4.25,2.25; 3 -4.25,1.75; 4 -4.25,1.25; 5 -4.25,0.75; 6 -4.25,0.25; 7 -4.25,-0.25; 8 -4.25,-0.75; 9 -4.25,-1.25; 10 -4.25,-1.75; 11 -4.25,-2.25; 12 -4.25,-2.75; 25 4.25,-2.75; 26 4.25,-2.25; 27 4.25,-1.75; 28 4.25,-1.25; 29 4.25,-0.75; 30 4.25,-0.25; 31 4.25,0.25; 32 4.25,0.75; 33 4.25,1.25; 34 4.25,1.75; 35 4.25,2.25; 36 4.25,2.75 | smd 0.305 x 1.194: 13 -2.75,-4.25; 14 -2.25,-4.25; 15 -1.75,-4.25; 16 -1.25,-4.25; 17 -0.75,-4.25; 18 -0.25,-4.25; 19 0.25,-4.25; 20 0.75,-4.25; 21 1.25,-4.25; 22 1.75,-4.25; 23 2.25,-4.25; 24 2.75,-4.25; 37 2.75,4.25; 38 2.25,4.25; 39 1.75,4.25; 40 1.25,4.25; 41 0.75,4.25; 42 0.25,4.25; 43 -0.25,4.25; 44 -0.75,4.25; 45 -1.25,4.25; 46 -1.75,4.25; 47 -2.25,4.25; 48 -2.75,4.25
JST-XH-04-PACKAGE-LONG-PAD = drill 1.016 long: 1 -3.81,0; 2 -1.27,0; 3 1.27,0; 4 3.81,0
SMA90_DIP = drill 1.5 pad 2.54: ANTENNA 0,0 | drill 1.6 pad 2.54: GND1 -2.54,2.54; GND2 2.54,2.54; GND3 -2.54,-2.54; GND4 2.54,-2.54
OSCCC500X320X110-4N = smd 1.9 x 1.4: 1 -2.2,-1.2; 2 2.2,-1.2; 3 2.2,1.2; 4 -2.2,1.2

### Placement (x,y rotation side)
APOGEE  4.57,54.15 90 bottom
B2  4.34,70.69 180 bottom
C1  19.8,16.8 180 top
C2  40.56,45.87 270 top
C3  46.43,41.25 0 top
C4  47.93,32.31 270 top
C5  15.14,76.58 90 bottom
C6  46.46,37.21 270 top
C7  38.25,56.21 0 top
C8  37.19,59.23 180 top
C9  33.48,67.89 90 top
C10  20.37,59.51 270 top
C11  32.97,62.99 180 top
C12  32.92,60.35 180 top
C13  24.21,68.63 90 top
C14  30.17,72.21 180 top
C15  28.5,44.7 0 top
C16  25.58,72.21 0 top
C17  37.39,63.35 270 top
C18  22.4,49.23 0 top
C19  24.89,44.75 180 top
C20  23.42,66.09 0 top
C21  20.8,46.46 90 top
C22  22.3,59.54 270 top
C23  33.12,58.14 180 top
C24  19.13,28.16 180 top
C25  10.64,79.22 180 bottom
C26  41.66,15.04 0 top
C27  15.16,80.19 90 bottom
C28  10.59,75.54 180 bottom
C29  41.68,25.73 0 top
C30  19.41,51.82 0 top
C31  39.4,69.8 90 bottom
C32  41.58,69.82 90 bottom
C33  15.85,16.73 270 top
C34  15.24,28.08 90 top
D1  12.98,83.82 270 bottom
D2  36.86,46.1 90 top
D3  40.33,51.36 270 top
D4  14.43,73 90 bottom
D5  18.31,12.04 270 top
D6  36.6,51.05 0 top
D7  40.21,76 0 bottom
D8  37.34,2.57 270 bottom
D9  39.65,2.69 270 bottom
D10  11.7,22.68 90 top
ESDA  11.76,47.12 180 top
ESDA1  12.22,55.63 180 top
F1  44.22,32.59 180 top
F3  37.36,67.97 0 top
J2  44.64,72.4 0 bottom
L2  18.01,46.23 180 top
MAIN  4.5,46.43 90 bottom
POWER  45.06,56.95 270 bottom
Q2  10.72,51.44 90 top
Q3  10.85,59.82 90 top
R1  40.44,74.19 180 bottom
R2  11,48.29 270 bottom
R3  40.13,77.88 0 bottom
R4  15.57,51.38 270 top
R5  40.41,72.42 180 bottom
R6  9.3,48.31 90 bottom
R7  20.68,42.27 90 top
R8  10.36,55.83 180 bottom
R9  26.85,64.77 180 top
R10  10.36,57.81 0 bottom
R11  29.26,46.84 180 top
R12  13.47,22.81 90 top
R16  11.07,68.1 180 bottom
R17  39.6,6.1 90 bottom
R18  27.1,61.8 90 top
R19  25.43,61.8 90 top
R20  13.87,51.44 90 top
R21  15.04,83.74 270 bottom
R22  14.15,65.61 180 bottom
R23  40.11,79.65 180 bottom
R24  39.34,82.3 270 bottom
R25  17.42,54.84 270 top
R26  37.31,5.99 90 bottom
R27  36.78,52.86 180 top
R28  14.43,69.09 270 bottom
R29  13.84,59.89 90 top
R30  15.77,59.87 270 top
SG1  13,37.9 0 top
STM  2.23,64.67 180 bottom
SW1  45.11,49.23 270 bottom
U1  21.22,22.72 270 top
U2  29.46,61.82 180 top
U3  28.14,68.71 180 top
U4  27.25,76.5 180 bottom
U5  31.8,23.04 90 bottom
U6  43.81,63.04 270 top
U7  39.47,37.49 90 top
U8  27.51,54 90 top
VDDA3  18.11,49.68 0 top
VDDA4  18.14,47.9 0 top
X1  3.07,34.98 90 bottom
X4  4.95,5.94 90 bottom
Y2  26.67,41.91 0 top

### Tracks (layer width: path | path; a pad name or v marks a point on that pad's centre or on a via)
3.3V  (via drill 0.38, 0.51)
  Top 0.305: U2.2 28.67,61.51 29.22,61.51 29.88,60.85 U2.8 31.57,60.85 C12.2 | L2.1 19.33,45.92 v19.33,44.78 19.2,44.91 19.2,45.86 20.65,47.31 C21.2 21.55,48.06 24.26,48.06 24.76,48.56 U8.1 | U2.6 30.47,62.15 31.32,62.99 C11.2 | v22.83,64.85 21.79,64.85 21.36,65.28 21.36,67.08 23.76,69.48 C13.2 24.68,69.96 U3.13 26.78,69.96 26.95,69.79 26.95,69.33 27.36,68.92 28.42,68.92 28.89,69.39 U3.8 28.89,71.78 C14.2 31.43,70.1 31.45,70.1 | 31.45,70.1 31.45,66.06 32.12,65.39 C11.2 | F3.2 38.48,67.97 36.35,70.1 31.45,70.1 | C11.2 32.12,60.4 | 32.12,60.4 C12.2 | 22.28,58.66 24.35,58.66 U8.36 | 32.12,60.4 33.49,61.77 34.47,61.77 35.13,61.11 35.13,54.63 34.24,53.75 34.24,51.74 34.92,51.05 D6.A 35.56,50.89 v35.56,49.1 | C12.2 32.07,58.34 C23.2 32.27,57.24 31.78,56.75 U8.24 | v18.82,53.54 18.82,53.52 19.61,52.73 19.96,52.73 20.26,52.44 C30.2 20.82,51.25 U8.48 | R18.2 R19.2 25.3,62.78 25.3,64.07 R9.2 | v28.58,48.44 30.11,46.9 R11.1
  Top 0.381: v43.54,68.55 42.62,67.64 39.09,67.64 F3.2
  Top 0.406: v22.86,57.51 22.86,58.13 C22.2 22.28,58.66 C10.2 20.18,58.66 19.08,59.77 19.08,60.83 15.24,64.67 STM.4 | v22.83,64.85 22.91,64.77 R9.2
  Bottom 0.305: v18.82,53.54 9.86,62.51 STM.4 | v19.33,44.78 22.1,47.55 28.58,47.55 | v22.83,64.85 22.86,64.82 v22.86,57.51 | v35.56,49.1 34.01,47.55 28.58,47.55 | 28.58,47.55 v28.58,48.44
  Bottom 0.381: v43.54,68.55 45.82,68.55 47.96,70.69 47.96,74.83 46.58,76.2 43.33,76.2 43.31,76.22 42.42,77.11 42.42,80.16 40.72,81.86 40.72,84.29 40.13,84.89 22.91,84.89 21.63,83.61 21.63,79.27 20.13,77.77 U4.4 15.48,77.77 C5.2 14.13,77.43 C28.+ 13.04,75.54 D4.A | STM.4 7.95,62.76 4.8,62.76 1.42,59.38 1.41,39.8 2.42,38.79 X1.4
  Bottom 0.406: 43.31,76.22 43.31,76.21 R1.2
5V  (via drill 0.76)
  Top 0.406: 45.83,15.06 C26.+
  Top 0.61: 45.83,15.06 C29.+ 45.83,29.1 F1.2 | C26.+ 44.91,15.04 v42.96,13.09
  Bottom 0.305: U5.VCC 41.94,10.31 41.94,8.44 40.44,6.95 R17.2
  Bottom 0.61: v42.96,13.09 41.96,12.09 U5.VCC
APG
  Top 1.524: Q3.3 8.79,59.82 7.29,58.31 7.29,55.7 5.74,54.15 APOGEE.1
  Bottom 0.305: R8.1 7.84,54.15 APOGEE.1
APG_F
  Top 0.305: R30.1 16.63,60.72 17.7,59.64 17.7,58.39 19.85,56.25 U8.38
APG_S  (via drill 0.38)
  Top 0.305: v29.77,54.51 30.03,54.25 U8.19
  Bottom 0.305: v29.77,54.51 26.64,54.51 24.74,52.6 13.25,52.6 11.21,54.64 R8.2
  Bottom 0.406: R10.1 R8.2
AUX  (via drill 0.38)
  Top 0.305: v39.73,19.46 38.58,19.46 33.83,24.21 33.83,51.18 33.26,51.75 U8.14
  Bottom 0.305: R26.2 37.31,7.07 39.42,9.18 U5.AUX 39.47,10.39 39.47,9.8 39.73,10.06 v39.73,19.46
BT0
  Top 0.305: R25.1 17.78,55.69 20.21,53.25 U8.44
BZZR
  Top 0.305: R7.2 22.02,44.49 22.02,47.07 22.4,47.45 24.61,47.45 25.26,48.09 U8.2 | U8.2 | U8.2
D
  pour Bottom: 49.28,82.55 arc90 45.97,85.95 arc90 42.11,82.58 arc90 45.8,79.07 arc90
  pour Bottom: 7.65,83.01 arc90 4.11,86.49 arc90 0.63,82.96 arc90 4.14,79.5 arc90
  pour Bottom: 49.22,3.76 arc90 45.72,7.26 arc90 42.21,3.73 arc90 45.72,0.25 arc90
  pour Bottom: 35.76,3.89 arc90 32.23,7.39 arc90 28.75,3.86 arc90 32.26,0.38 arc90
  pour Top: 0.63,83.01 arc-90 4.17,86.49 arc-90 7.65,83.01 arc-90 4.06,79.5 arc-90
  pour Top: 42.11,82.58 arc-90 45.97,85.95 arc-90 49.28,82.55 arc-90 45.8,79.07 45.75,79.07 arc-90
  pour Top: 42.21,3.73 arc-90 45.75,7.26 arc-90 49.22,3.76 arc-90 45.64,0.25 arc-90
  pour Top: 28.75,3.94 arc-90 32.23,7.39 arc-90 35.76,3.86 arc-90 32.23,0.38 arc-90
D1
  pour Bottom: 7.66,22.99 arc90 4.13,26.47 arc90 0.65,22.99 arc90 4.18,19.46 arc90
  pour Top: 0.65,22.99 arc-90 4.13,26.47 4.15,26.47 arc-90 7.66,22.94 arc-90 4.18,19.46 arc-90
FN  (via drill 0.38)
  Top 0.305: U8.25 30.26,59.24 v30.63,59.61
  Bottom 0.305: R23.1 37.38,81.53 33.37,81.53 32.61,80.77 32.61,61.29 30.94,59.61 v30.63,59.61
GND  (via drill 0.38, 0.41)
  Top 0.229: U8.8 28.26,50.58 27.97,50.88
  Top 0.254: 27.97,50.88 27.33,51.51 v26.67,51.51
  Top 0.305: U3.11 27.39,70.19 v27.91,69.67 | U8.47 24.06,51.75 24.89,52.58 v24.89,54.15 | U2.1 29.51,60 v29.51,59.69 | U3.18 27.17,67.46 v27.79,68.07
  other vias: 9.83,14.43 8.76,14.38 7.72,14.4 6.73,13.97 5.97,13.13 5.92,12.01 5.94,10.95 5.97,9.83 3.94,9.83 3.96,10.92 3.94,11.99 3.96,13.08 4.14,14.17 4.77,15.04 5.56,15.77 6.35,16.56 31.29,61.67 31.11,64.24 21.51,61.75 19.2,43.66 15.85,48.87 20.32,49.76 16.92,51.28 8.89,53.26 7.72,53.26 6.63,52.73 5.59,52.02 4.42,51.99 8.97,61.59 7.8,61.62 6.71,61.62 5.51,61.59 4.62,60.76 3.83,59.92 42.24,58.57 42.21,57.38 42.27,56.36 42.27,55.22 42.27,54.15 42.24,53.14 17.51,79.55 17.54,76.1 6.01,75.88
  pour Top (rank 2): 49.99,87.76 49.99,-0.38 -0.25,-0.38 -0.25,87.76
  pour Bottom (rank 2): 50.01,87.76 50.01,-0.43 -0.31,-0.43 -0.31,87.76
HT
  pour Top: 39.9,41.66 39.9,33.02 39.27,32.38 36.14,32.38 34.52,34.01 34.52,41.12 35.92,42.52 39.04,42.52
HT2
  pour Top: 48.72,65.25 47.09,66.88 44.4,66.88 42.98,65.46 42.98,60.4 44.37,59 47.7,59 48.72,60.02
HT3
  pour Top: 21.32,20.03 21.32,25.7 23.66,28.04 26.76,28.04 28.94,25.86 28.94,19.8 26.81,17.67 23.69,17.67
INT
  Top 0.305: U3.12 26.68,70.89 23.67,70.89 20.62,67.84 20.62,65.06 23.95,61.73 23.95,60.43 24.49,59.89 25.83,59.89 26.26,59.47 U8.33
M0  (via drill 0.38)
  Top 0.305: v29.36,13.56 29.36,19.05 31.32,21.01 31.32,47.7 30.86,48.16 29.74,48.16 29.27,48.63 29.27,48.73 29.26,48.74 U8.10
  Bottom 0.305: v29.36,13.56 29.26,13.46 U5.M0
M1  (via drill 0.38)
  Top 0.305: v31.9,13.56 31.9,19.99 31.88,20.01 31.88,48.03 31.22,48.69 29.97,48.69 29.76,48.91 U8.11
  Bottom 0.305: v31.9,13.56 31.8,13.46 U5.M1
MAIN
  Top 1.524: Q2.3 7.56,51.43 6.06,49.93 MAIN.2
  Bottom 0.305: R2.1 11,50.04 9.91,51.13 5.69,51.13 MAIN.2
MAIN_F
  Top 0.305: R4.1 16.1,52.77 16.1,56.41 16.61,56.92 18.39,56.92 19.56,55.75 U8.39
MAIN_S  (via drill 0.38)
  Top 0.305: U8.18 30.03,53.75 v29.77,53.49
  Bottom 0.305: v29.77,53.49 26.72,53.49 25.25,52.02 13.46,52.02 12.52,51.08 12.52,48.18 11.76,47.42 11.01,47.42 R2.2 9.32,47.44 R6.1
N$1
  Top 0.61: U7.3 42.82,39.81 44.26,41.25 C3.1 42.61,44.22 C2.A 37.13,44.22 D2.1
N$2
  Top 0.381: U6.3
  Top 0.61: D3.1 40.34,55.78 C7.A 38.04,58.08 C8.1 38.97,59.23 U6.3
N$3
  Bottom 0.406: R1.1 36.05,74.19 U4.10
N$4
  Top 0.381: 44.75,35.56 C6.A
  Top 0.61: U7.2 44.75,35.56 | C6.A 46.46,34.63 C4.1 46.19,33.16 F1.1
N$5
  Top 0.61: U6.2 38.73,63.04 C17.A 33.48,65.61 C9.1 35.04,67.04 F3.1
N$6
  Top 0.813: Q3.1 11.95,58 ESDA1.1 13.84,56.1 R29.1 13.87,59.02 R30.2
N$7
  Bottom 0.61: X4.ANTENNA 4.95,13.6 7.42,16.07 U5.ANT
N$8
  Top 0.305: R7.1 17.16,37.9 SG1.+
N$9
  Top 1.524: POWER.1 46.56,56.95 47.75,55.75 47.74,46.83 46.64,45.72 SW1.2
N$10
  Bottom 0.305: R21.2 19.47,82.89 U4.6
N$11
  Bottom 0.406: R21.1 13.08,84.59 D1.A
N$12
  Bottom 0.381: R16.2 11.92,69.73 14.04,71.85 D4.C
N$13
  Top 0.813: Q2.1 11.82,49.16 ESDA.1 13.86,50.58 R20.1 15.52,50.58 R4.2
N$14
  Bottom 0.381: R17.1 39.6,3.62 D9.A
N$15
  Top 0.305: D6.C 37.63,51.2 R27.1
N$16
  Bottom 0.406: U4.8 37.44,77.88 R3.2
N$17
  Bottom 0.406: R3.1 40.98,76.1 D7.A
N$18
  Top 0.305: U3.10 27.89,71.6 27.28,72.21 C16.2
N$19
  Bottom 0.305: C32.2 41.58,72.1 R5.2 41.28,72.4 J2.FEED
N$20
  Bottom 0.305: R23.2 40.96,79.83 R24.2 37.94,82.85 U4.7
N$21
  Bottom 0.305: R26.1 37.31,3.47 D8.A
N$22
  Top 0.305: U3.20 27.39,66.16 27.09,65.86 24.5,65.86 C20.2
N$23
  Top 1.016: D5.1 18.15,13.8 C1.A 17.38,17.58 C33.1 15.85,18.4 U1.3
N$25
  Top 0.305: D10.A 11.85,21.96 R12.1
NRST
  Top 0.254: 23.25,49.45 24.5,50.69 27.54,50.69 27.76,50.47 U8.7
  Top 0.305: 23.25,49.45 C18.2 | R11.2 27.78,48.15 27.76,48.17 U8.7
OSC_IN
  Top 0.305: Y2.1 25.91,42.15 25.91,44.59 C19.1 26.78,45.8 26.76,45.82 U8.5
OSC_OUT
  Top 0.305: 27.28,45.07 27.28,44.7 Y2.3 27.65,44.33 C15.1 27.28,45.07 | U8.6 27.26,45.09 27.28,45.07
PIN22
  Top 0.305: R9.1 28.39,65.47 U3.22
RX1  (via drill 0.38)
  Top 0.305: v20.57,54.25 21.49,54.25 21.99,53.75 U8.43
  Bottom 0.305: v20.57,54.25 20.57,68.81 21.41,69.65 21.41,72.08 20.8,72.69 U4.2
RX2  (via drill 0.38)
  Top 0.305: v36.86,17.73 36.86,19.13 33.19,22.8 33.19,50.94 32.88,51.25 U8.13
  Bottom 0.305: v36.86,17.73 36.86,10.36 U5.TX
RX3  (via drill 0.38)
  Top 0.305: v17.22,44.42 17.22,44.32 14.07,41.17 8.31,41.17 3.38,36.25 X1.3 | v34.21,56.34 33.63,55.75 U8.22
  Bottom 0.305: v17.22,44.42 17.22,45.29 22,50.06 30.3,50.06 32.92,52.68 32.92,55.83 33.43,56.34 v34.21,56.34
SCL  (via drill 0.38, 0.51)
  Top 0.305: U3.23 28.89,63.03 U2.4 28.19,63.27 v28.19,63.6 | v23.95,63.09 24.46,62.59 24.46,61.37 24.88,60.95 R19.1 | U8.30 27.76,59.05 v28.42,59.72
  Bottom 0.305: v28.42,59.72 28.19,59.94 v28.19,63.6 24.46,63.6 v23.95,63.09
SDA
  Top 0.305: U3.24 29.39,62.59 28.95,62.15 U2.3 28.43,62.15 27.18,60.9 27.12,60.97 R18.1 27.26,60.79 U8.31
SWCLK
  Top 0.305: STM.2 4.72,64.62 4.72,63.78 5.37,63.13 15.53,63.13 18.29,60.38 18.29,58.88 20.41,56.75 U8.37
SWDIO
  Top 0.305: STM.3 7.19,64.8 7.19,66.09 8.59,67.49 17.22,67.49 23.26,61.45 23.26,60.26 24.16,59.36 25.48,59.36 25.76,59.08 U8.34
TX1  (via drill 0.38)
  Top 0.305: v19.61,54.99 21.59,54.99 22.33,54.25 U8.42
  Bottom 0.305: v19.61,54.99 19.61,62.41 17.81,64.21 13.97,64.21 13.3,64.88 R22.1
TX2  (via drill 0.38)
  Top 0.305: v34.44,13.56 34.44,19.28 32.59,21.13 32.59,48.84 31.68,49.75 U8.12
  Bottom 0.305: v34.44,13.56 34.34,13.46 U5.RX
TX3  (via drill 0.38)
  Top 0.305: v18.21,44.37 18.21,43.92 14.5,40.21 8.5,40.21 6.5,38.2 6.5,35.48 4.72,33.71 X1.2 | v34.19,55.24 U8.21
  Bottom 0.305: v18.21,44.37 18.21,45.39 22.15,49.33 31.83,49.33 34.19,51.69 v34.19,55.24
TXD
  Bottom 0.305: R22.2 15,67.67 R28.2 16.09,68.24 18.01,70.15 U4.1
V_BCKP
  Bottom 0.381: R16.1 10.22,68.93 B2.+ 10.6,69.94 11.25,70.59 11.25,72.44 10.52,73.18 10.52,77.41 C25.+ 12.37,79.22 14.18,81.04 C27.2 18.78,81.04 U4.5
VCC  (via drill 1.27)
  Top 0.61: D2.2 38.91,49.76 D3.2 44.58,49.76 SW1.1
  Top 1.016: v42.19,42.11 42.19,42.01 40.88,40.7 40.88,29.13 41.76,28.26 41.76,14.27 37.67,10.19 18.57,10.19 D5.2
  Bottom 1.016: v42.19,42.11 43.14,43.07 43.14,47.26 SW1.1
VDDA
  Top 0.254: U8.9 28.75,50.75 27.28,52.22 25.39,52.22 23.69,50.52 20.5,50.52 20.24,50.77 17.5,50.77 17.26,50.53 VDDA3.1 17.26,47.93 VDDA4.1 16.99,47.61 L2.2
  Top 0.305: U8.9
VOUT  (via drill 1.27)
  Top 0.305: C34.1 13.47,25.46 R12.2
  Top 1.016: U1.2 15.24,25.36 C34.1 16.55,27.23 C24.A 17.48,33.45 v13,37.92 | MAIN.1 2.34,48.59 2.34,55.99 4,57.65 APOGEE.2
  Bottom 1.016: MAIN.1 v13,37.92
XANT
  Bottom 0.305: C31.2 39.4,72.25 R5.1 35.28,72.42 U4.11

### Text on the board
bPlace: IO | CLK | 3.3 | GND | 3.3 | RX3 | TX3 | GND | MERGEN / 09.03.2021